# Altium schematic sheet LED.SchDoc
size A4
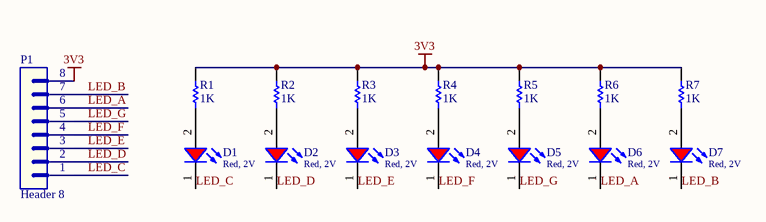
[diagram p0: LED.SchDoc]

## Parts
D1  Red, 2V  [WL-SMCW_0805]
D2  Red, 2V  [WL-SMCW_0805]
D3  Red, 2V  [WL-SMCW_0805]
D4  Red, 2V  [WL-SMCW_0805]
D5  Red, 2V  [WL-SMCW_0805]
D6  Red, 2V  [WL-SMCW_0805]
D7  Red, 2V  [WL-SMCW_0805]
P1  Header 8  [JP8]
R1  value 1K  [RES-SM-0805]  (hidden comment: Res-1K-0805)
R2  value 1K  [RES-SM-0805]  (hidden comment: Res-1K-0805)
R3  value 1K  [RES-SM-0805]  (hidden comment: Res-1K-0805)
R4  value 1K  [RES-SM-0805]  (hidden comment: Res-1K-0805)
R5  value 1K  [RES-SM-0805]  (hidden comment: Res-1K-0805)
R6  value 1K  [RES-SM-0805]  (hidden comment: Res-1K-0805)
R7  value 1K  [RES-SM-0805]  (hidden comment: Res-1K-0805)

## Nets
3V3: P1.8 R1.2 R2.2 R3.2 R4.2 R5.2 R6.2 R7.2
LED_A: D6.1(K) P1.6
LED_B: D7.1(K) P1.7
LED_C: D1.1(K) P1.1
LED_D: D2.1(K) P1.2
LED_E: D3.1(K) P1.3
LED_F: D4.1(K) P1.4
LED_G: D5.1(K) P1.5
NetD1_2: D1.2(A) R1.1
NetD2_2: D2.2(A) R2.1
NetD3_2: D3.2(A) R3.1
NetD4_2: D4.2(A) R4.1
NetD5_2: D5.2(A) R5.1
NetD6_2: D6.2(A) R6.1
NetD7_2: D7.2(A) R7.1

## Library data of the parts
D1-D7 = 150080RS75000: WL-SMCW SMT Mono-color Chip LED Waterclear, size 0805, Red, 2V, 140deg; Chip Technology: AlInGaP; Dominant Wavelength typ.: 625nm; Luminous Intensity typ.: 150mcd; Peak Wavelength typ.: 630nm; Viewing Angle: 140deg; ComponentLink1Description: Manufacturer; ComponentLink1URL: http://www.we-online.de; ComponentLink2URL: https://www.we-online.com/catalog/datasheet/150080RS75000.pdf; ComponentLink2Description: Datasheet; Forward Voltage typ.: 2V; Emitting Color: Red; Mounting Technology: SMT; Operating Temperature: -40 to +85degC; Published Date: December 2019; Part Number: 150080RS75000; Packaging: Tape and Reel; Size: 0805; Publisher: Wurth Elektronik
P1 = Header 8: Header, 8-Pin; LatestRevisionDate: 17-Jul-2002; LatestRevisionNote: Re-released for DXP Platform.; Publisher: Altium Limited
R1-R7 = Res-1K-0805: RES 1K OHM 1% 1/4W 0805; Manufacturer: Stackpole Electronics Inc; Manufacturer Part Number: RNCP0805FTD1K00; Local Supplier: thegioiic; Local Supplier Link: https://thegioiic.com/products/dien-tro-1k-ohm-0805-5; Supplier 1: Digikey; Supplier 1 Link: https://www.digikey.com/product-detail/en/stackpole-electronics-inc/RNCP0805FTD1K00/RNCP0805FTD1K00CT-ND/2240568; Supplier 1 Part Number: RNCP0805FTD1K00CT-ND